# EAGLE design Injector_2.0v (EAGLE 6.5.0)
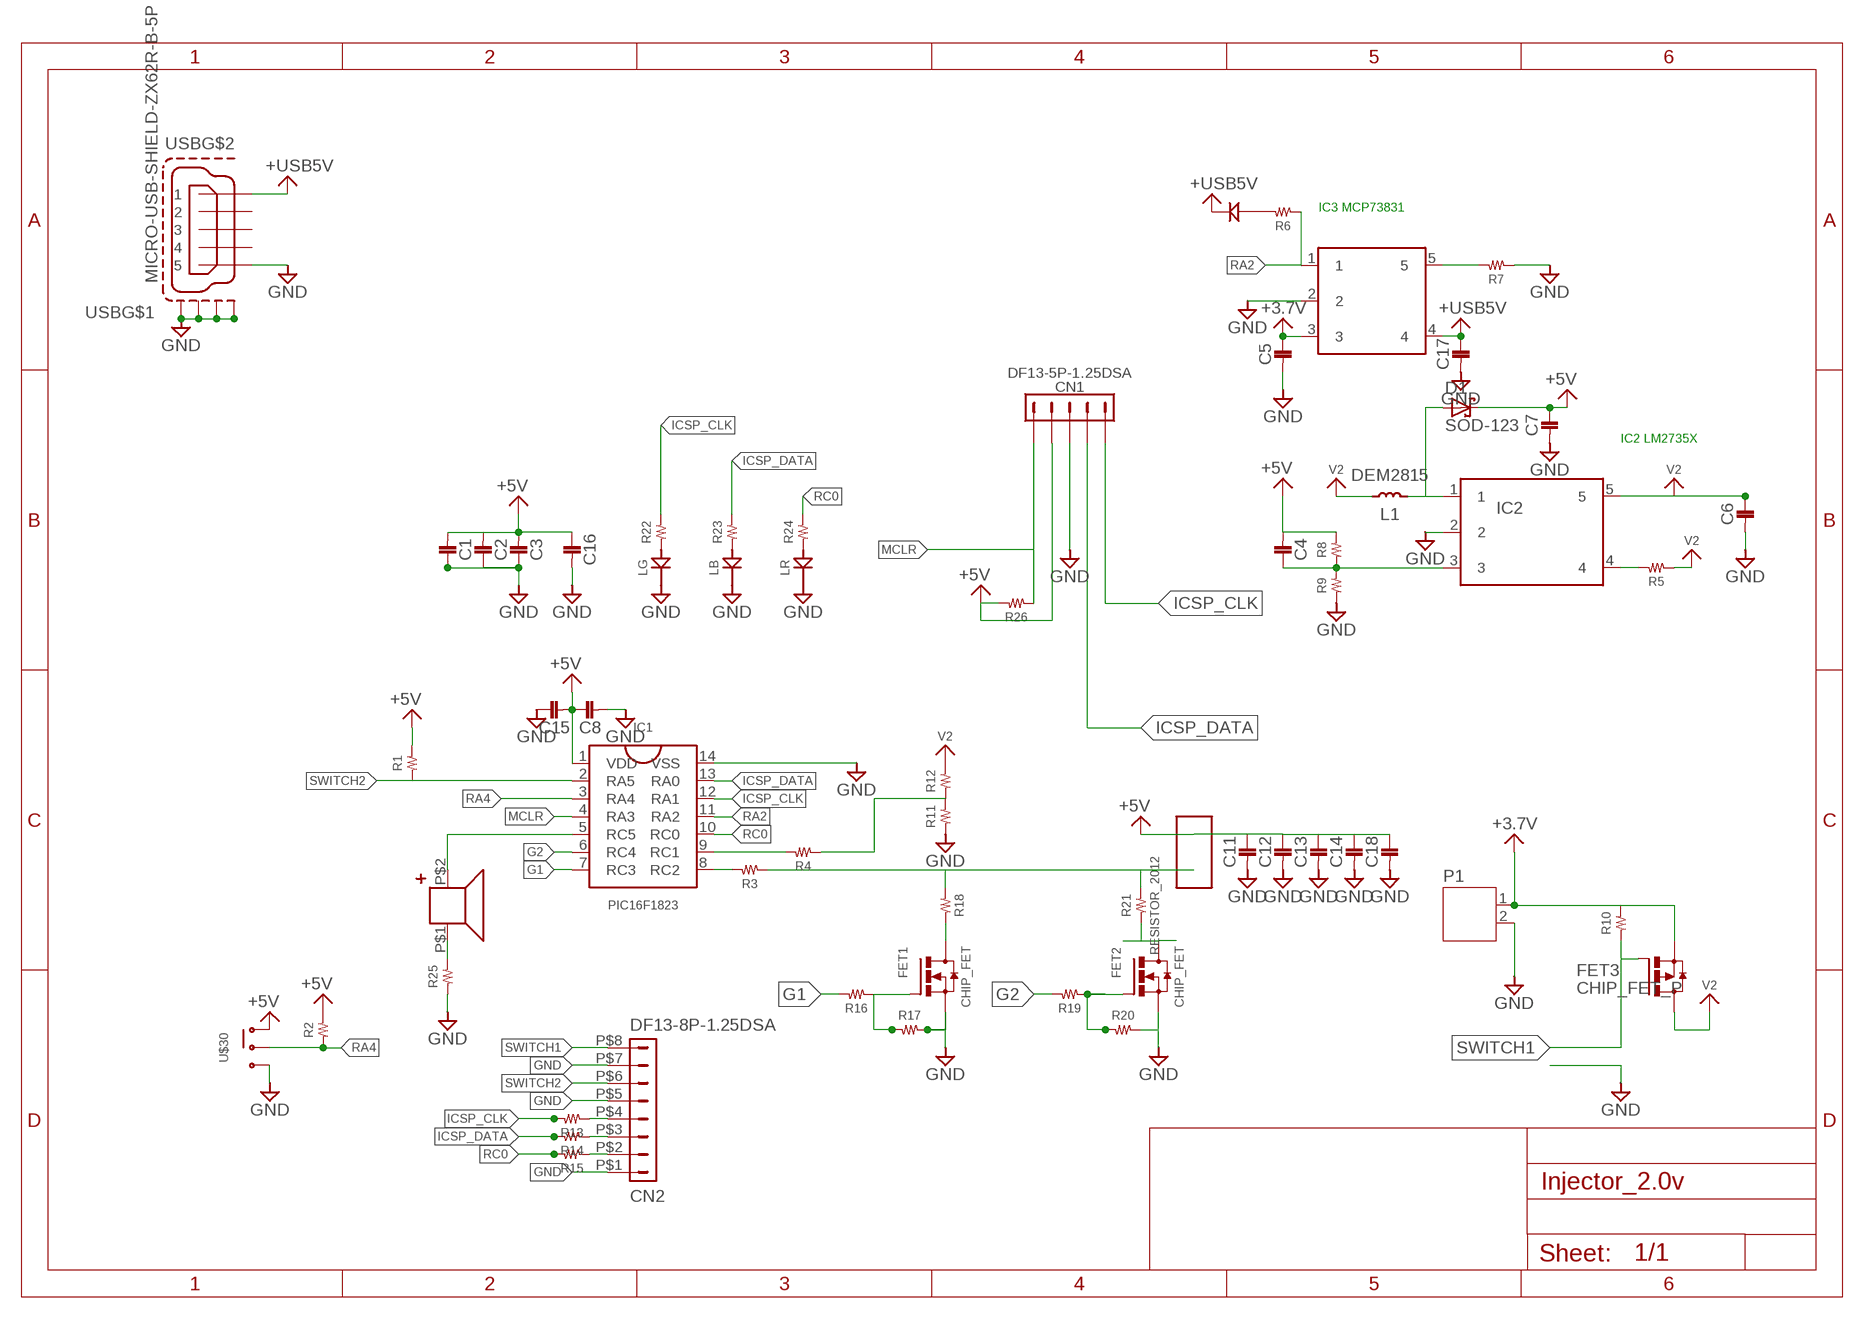
[diagram p0: schematic, sheet 1]

## Parts
C1  1608  [1608]
C2  1608  [1608]
C3  1608  [1608]
C4  1608  [1608]
C5  1608  [1608]
C6  1608  [1608]
C7  1608  [1608]
C8  1608  [1608]
C11  1608  [1608]
C12  1608  [1608]
C13  1608  [1608]
C14  1608  [1608]
C15  1608  [1608]
C16  1608  [1608]
C17  1608  [1608]
C18  1608  [1608]
CN1  DF13-5P-1.25DSA  [DF13-5P-1.25DSA]
CN2  DF13-8P-1.25DSA  [DF13-8P-1.25DSA]
D1  SOD-123  [SOD_123]
FET1  CHIP_FET  [SOT23]
FET2  CHIP_FET  [SOT23]
FET3  CHIP_FET_P  [SOT23]
IC1  PIC16F1823  [TSSOP]
IC2  LM2735  [SOT23-5L]
IC3  MCP73831  [SOT23-5L]
L1  DEM2815  [DEM2815]
LB  CHIPLED  [1608]
LG  CHIPLED  [1608]
LR  CHIPLED  [1608]
P1  JST-PH2  [JST-PH2]
R1  RESISTOR__SMD  [1608]
R2  RESISTOR__SMD  [1608]
R3  RESISTOR__SMD  [1608]
R4  RESISTOR__SMD  [1608]
R5  RESISTOR__SMD  [1608]
R6  RESISTOR__SMD  [1608]
R7  RESISTOR__SMD  [1608]
R8  RESISTOR__SMD  [1608]
R9  RESISTOR__SMD  [1608]
R10  RESISTOR__SMD  [1608]
R11  RESISTOR__SMD  [1608]
R12  RESISTOR__SMD  [1608]
R13  RESISTOR__SMD  [1608]
R14  RESISTOR__SMD  [1608]
R15  RESISTOR__SMD  [1608]
R16  RESISTOR__SMD  [1608]
R17  RESISTOR__SMD  [1608]
R18  RESISTOR__SMD  [1608]
R19  RESISTOR__SMD  [1608]
R20  RESISTOR__SMD  [1608]
R21  RESISTOR_2012  [2012]
R22  RESISTOR__SMD  [1608]
R23  RESISTOR__SMD  [1608]
R24  RESISTOR__SMD  [1608]
R25  RESISTOR__SMD  [1608]
R26  RESISTOR__SMD  [1608]
ST  1608  [1608]
U$15  PKLCS1212E4001  [PKLCS1212E4001]
U$16  PIN_HEADER_2_LARGE  [PIN_HEADER_2S_LARGE]
U$30  SS12D01G4  [SS12D01G4]
USB  MICRO-USB-SHIELD-ZX62R-B-5P  [ZX62R-B-5P]

## Nets
+3.7V: C5.P$1 FET3.2(S) IC3.3 P1.1 R10.2
+5V: C1.P$2 C2.P$2 C3.P$2 C4.P$2 C7.P$1 C8.P$1 C11.P$1 C12.P$1 C13.P$1 C14.P$1 C15.P$2 C16.P$1 C18.P$1 CN1.P$2 D1.C IC1.1(VDD) R1.2 R2.2 R8.2 R26.2 U$16.P$2 U$30.1
+USB5V: C17.P$1 IC3.4 ST.2(K) USB.1
G1: IC1.7(RC3) R16.2
G2: IC1.6(RC4) R19.2
GND: C1.P$1 C2.P$1 C3.P$1 C5.P$2 C6.P$2 C7.P$2 C8.P$2 C11.P$2 C12.P$2 C13.P$2 C14.P$2 C15.P$1 C16.P$2 C17.P$2 C18.P$2 CN1.P$3 CN2.P$1 CN2.P$5 CN2.P$7 FET1.2(S) FET2.2(S) IC1.14(VSS) IC2.2 IC3.2 LB.2(K) LG.2(K) LR.2(K) P1.2 R7.1 R9.1 R11.1 R17.2 R20.2 R25.1 U$30.3 USB.5 USB.M1(S1) USB.M2(S2) USB.M3(S3) USB.M4(S4)
ICSP_CLK: CN1.P$5 IC1.12(RA1) R13.2 R22.2
ICSP_DATA: CN1.P$4 IC1.13(RA0) R14.2 R23.2
MCLR: CN1.P$1 IC1.4(RA3) R26.1
N$1: FET1.1(G) R16.1 R17.1
N$2: FET2.1(G) R19.1 R20.1
N$3: FET1.3(D) R18.2
N$4: FET2.3(D) R21.1
N$5: IC1.5(RC5) U$15.P$2(PLUS)
N$6: R25.2 U$15.P$1(MINUS)
N$8: IC1.8(RC2) R3.2
N$9: IC1.9(RC1) R4.2
N$10: LG.1(A) R22.1
N$11: R3.1 R18.1 R21.2 U$16.P$1
N$12: LB.1(A) R23.1
N$13: D1.A IC2.1 L1.P$2
N$16: IC3.5 R7.2
N$17: LR.1(A) R24.1
N$18: C4.P$1 IC2.3 R8.1 R9.2
N$19: IC2.4 R5.2
N$20: R4.1 R11.2 R12.1
N$21: CN2.P$4 R13.1
N$22: CN2.P$3 R14.1
N$23: CN2.P$2 R15.1
N$24: R6.2 ST.1(A)
RA2: IC1.11(RA2) IC3.1 R6.1
RA4: IC1.3(RA4) R2.1 U$30.2
RC0: IC1.10(RC0) R15.2 R24.2
SWITCH1: CN2.P$8 FET3.1(G) R10.1
SWITCH2: CN2.P$6 IC1.2(RA5) R1.1
V2: C6.P$1 FET3.3(D) IC2.5 L1.P$1 R5.1 R12.2
Unconnected: USB.2 USB.3 USB.4

## Notes on the sheet
- IC3 MCP73831
- IC2 LM2735X

## Library data of the parts
C1-C8 C11-C18 = 02_C:1608
CN1 = con-hirose-df13:DF13-5P-1.25: DF13-5P 1.25mm Pitch Miniature Crimping Connector.
CN2 = con-hirose-df13:DF13-8P-1.25: DF13-8P 1.25mm Pitch Miniature Crimping Connector.
D1 = 15_DIODE:SOD-123
FET1 FET2 = 06_FET:CHIP_FET
FET3 = 06_FET:CHIP_FET_P
IC1 = 04_IC:PIC16F1823
IC2 = 04_IC:LM2735
IC3 = 04_IC:MCP73831
L1 = 03_L:DEM2815
LB LG LR = 10_LED:CHIPLED
P1 = jst-ph:JST-PH2
R1-R20 R22-R26 = 01_R:RESISTOR__SMD
R21 = 01_R:RESISTOR_2012
ST = 10_LED:1608
U$15 = 13_SPEAKER:PKLCS1212E4001
U$16 = 08_CONECTOR:PIN_HEADER_2_LARGE
U$30 = 09_1_switch:SS12D01G4
USB = con-hirose1:MICRO-USB-SHIELD-: Hirose Micro USB Connector ZX62R-B-5P: Micro B, reverse (top mount) shell SMT Supplier: DigiKey H11574CT-ND Source: http://www.hirose.co.jp/cataloge_hp/e24200011.pdf

## Board
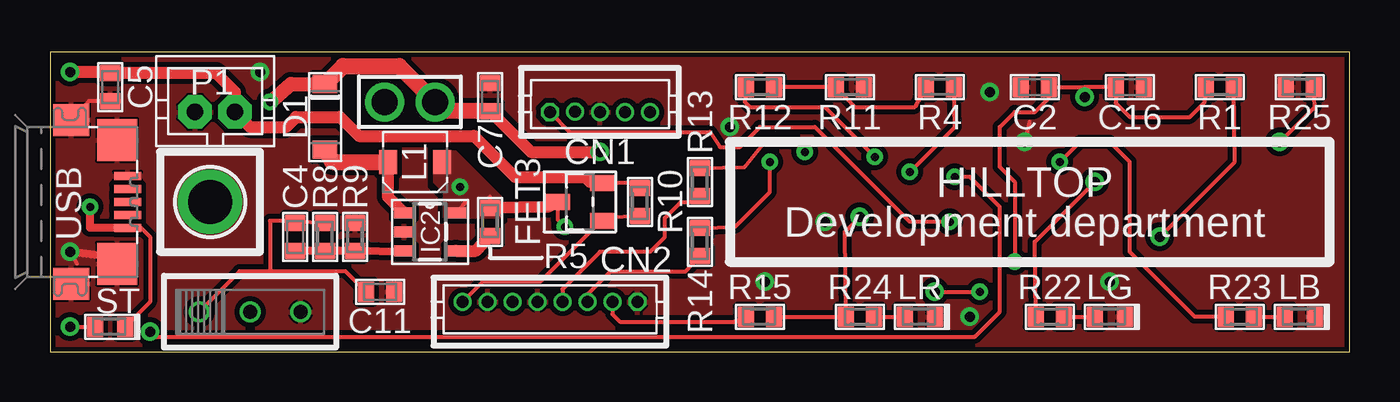
[diagram p1: board, top side]
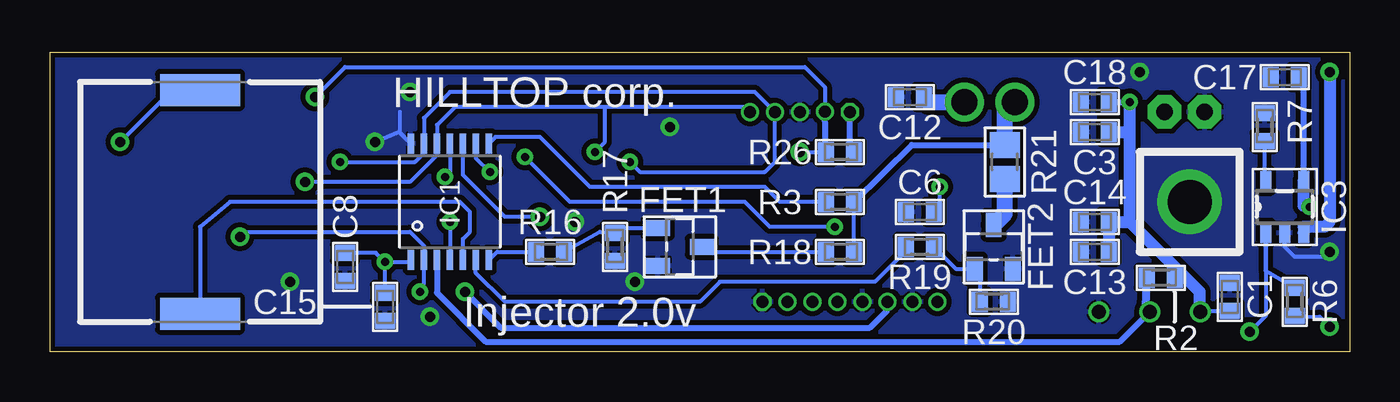
[diagram p2: board, bottom side, seen from below]

Size 65 x 15 mm. Coordinates in mm from the lower left corner, seen from the top.
Outline: 0,0 65,0 65,15 0,15 0,0
Copper layers (1*16): Top 0.035mm / dielectric 1.5mm / Bottom 0.035mm
Design rules "default *": minimum track width 0.2mm, minimum drill 0.4mm, track to track 0.2mm, track to pad 0.2mm, pad to pad 0.2mm, via to via 0.2mm, smd to smd 0.2mm, copper to edge 0.1mm, drill to drill 0.2mm, minimum pad ring 0.15mm, minimum via ring 8mil, stop-mask expansion 4mil, vias tented up to drill 0.5mm, thermal gap 0.1mm
tKeepout: area 6,5.5 to 10,9.5

### Footprints (pad centres in the part's own frame; a part is rotated, then mirrored left to right if it is on the bottom)
1608 = smd 0.8 x 1: P$1 -0.7,0; P$2 0.7,0
DF13-5P-1.25DSA = drill 0.6 pad 0.9 octagon: P$1 2.5,0.005 | drill 0.6 pad 0.9: P$2 1.25,-0.005; P$3 0,0; P$4 -1.25,0; P$5 -2.5,0
DF13-8P-1.25DSA = drill 0.6 pad 0.9 octagon: P$1 4.375,0 | drill 0.6 pad 0.9: P$2 3.125,0; P$3 1.875,0; P$4 0.625,0; P$5 -0.625,0; P$6 -1.875,0; P$7 -3.125,0; P$8 -4.375,0
SOD_123 = smd 0.915 x 1.22: A -1.64,0; C 1.64,0
SOT23 = smd 0.8 x 1.2: 1 -0.95,-1.1; 2 0.95,-1.1; 3 0,1.1
TSSOP = smd 0.305 x 0.991: 1 -1.95,-2.918; 2 -1.3,-2.918; 3 -0.65,-2.918; 4 0,-2.918; 5 0.65,-2.918; 6 1.3,-2.918; 7 1.95,-2.918; 8 1.95,2.918; 9 1.3,2.918; 10 0.65,2.918; 11 0,2.918; 12 -0.65,2.918; 13 -1.3,2.918; 14 -1.95,2.918
SOT23-5L = smd 0.55 x 1: 1 -0.95,-1.3; 2 0,-1.3; 3 0.95,-1.3; 4 0.95,1.3; 5 -0.95,1.3
DEM2815 = smd 0.9 x 1.2: P$1 -1.35,0; P$2 1.35,0
1608' = smd 0.8 x 1: 1 -0.75,0; 2 0.75,0
JST-PH2 = drill 0.813 pad 1.676 octagon: 1 1,0; 2 -1,0
1608'' = smd 0.8 x 1: 1 -0.7,0; 2 0.7,0
2012 = smd 1.3 x 1.5: 1 -0.85,0; 2 0.85,0
PKLCS1212E4001 = smd 1.6 x 4: P$1 -5.6,0; P$2 5.6,0
PIN_HEADER_2S_LARGE = drill 1.3: P$1 -1.27,0; P$2 1.27,0
SS12D01G4 = drill 0.7: 1 -2.54,0; 2 0,0; 3 2.54,0
ZX62R-B-5P = smd 1.35 x 0.4: 1 2.875,-1.3; 2 2.875,-0.65; 3 2.875,0; 4 2.875,0.65; 5 2.875,1.3 | smd 1.8 x 1.6: M1 0.05,-4.1; M2 0.05,4.1 | smd 2 x 2.1: M3 2.35,3.1; M4 2.35,-3.1

### Placement (x,y rotation side)
C1  6,2.75 270 bottom
C2  49.25,13.25 0 top
C3  12.75,11 0 bottom
C4  12.25,5.75 90 top
C5  3,13.25 270 top
C6  21.5,7 180 bottom
C7  22,12.75 90 top
C8  50.25,4.25 270 bottom
C11  16.5,3 0 top
C12  22,12.75 180 bottom
C13  12.75,5 180 bottom
C14  12.75,6.5 180 bottom
C15  48.25,2.25 90 bottom
C16  54,13.25 0 top
C17  3.25,13.75 180 bottom
C18  12.75,12.5 180 bottom
CN1  27.5,12 180 top
CN2  25,2.5 0 top
D1  13.75,11.75 90 top
DRILEGEND  [DRILEGEND]  -15.05,-17.26 0 top  (outside the outline)
FET1  33.5,5.25 270 bottom
FET2  17.8,5.25 0 bottom
FET3  26.5,7.5 90 top
IC1  45,7.5 0 bottom
IC2  19,6 270 top
IC3  3.25,7.25 0 bottom
L1  18.25,9.5 180 top
LB  CHIPLED  [1608']  62.5,1.75 0 top
LG  CHIPLED  [1608']  53,1.75 0 top
LR  CHIPLED  [1608']  43.5,1.75 0 top
P1  8.25,12 0 top
R1  [1608'']  58.5,13.25 180 top
R2  [1608'']  9.45,3.7 0 bottom
R3  [1608'']  25.5,7.5 180 bottom
R4  [1608'']  44.5,13.25 0 top
R5  [1608'']  22,6.5 270 top
R6  [1608'']  2.75,2.5 270 bottom
R7  [1608'']  4.25,11.25 270 bottom
R8  [1608'']  13.75,5.75 90 top
R9  [1608'']  15.25,5.75 270 top
R10  [1608'']  29.5,7.5 90 top
R11  [1608'']  40,13.25 180 top
R12  [1608'']  35.5,13.25 180 top
R13  [1608'']  32.5,8.5 90 top
R14  [1608'']  32.5,5.5 90 top
R15  [1608'']  35.5,1.75 0 top
R16  [1608'']  40,5 180 bottom
R17  [1608'']  36.75,5.25 270 bottom
R18  [1608'']  25.5,5 180 bottom
R19  [1608'']  21.5,5.25 180 bottom
R20  [1608'']  17.8,2.5 0 bottom
R21  17.25,9.5 90 bottom
R22  [1608'']  50,1.75 180 top
R23  [1608'']  59.5,1.75 180 top
R24  [1608'']  40.5,1.75 180 top
R25  [1608'']  62.5,13.25 0 top
R26  [1608'']  25.5,10 180 bottom
ST  1608  [1608']  3,1.25 0 top
U$15  57.5,7.5 270 bottom
U$16  18,12.5 0 top
U$30  10,2 0 top
USB  1,7.5 0 top

### Tracks (layer width: path | path; a pad name or v marks a point on that pad's centre or on a via)
+3.7V  (via drill 0.5)
  Top 0.2: C5.P$1 3,14 | R10.2 29.3,8.45 FET3.2
  Top 0.4: v1,14 1.05,13.95
  Top 0.6: FET3.2 27.55,8.5 27,8.5 26.75,8.75 23.25,8.75 21.2,10.8 15.45,10.8 14.5,11.75 12.3,11.75 11.8,11.25 10,11.25 P1.1 9.25,13 8.3,13.95 C5.P$1 2.95,14 v1,14
  Bottom 0.6: v1,14 1,6.5 1.25,6.25 2.3,6.25 IC3.3
+5V  (via drill 0.4, 0.5)
  Top 0.2: 7.5,2 U$30.1 9.48,4.02 11,4.02 | v48.25,4.5 48.25,8.5 47.5,9.25 47.5,11.25 48.25,12 49.25,12 49.95,12.7 C2.P$2 51.75,13.25 | 51.75,13.25 v51.75,12.75 | 12,6.75 C4.P$2 | C4.P$2 12,6.54 11,6.54 11,4.02 | R8.2 12.3,6.5 C4.P$2 | 51.75,13.25 C16.P$1 53.3,12.45 54,11.75 57,11.75 57.75,12.5 R1.2 | C11.P$1 14.78,4.02 11,4.02
  Top 0.6: C7.P$1 24.05,10 v27.5,10
  Top 0.7: v11,12.5 12.04,13.39 D1.C
  Top 0.8: C7.P$1 19.72,12.05 U$16.P$2 17.47,14.3 14.66,14.3 D1.C
  Bottom 0.2: 46.95,4.55 IC1.1 47.03,4.5 v48.25,4.5 | v51.75,12.75 50.25,14.25 27.25,14.25 26.25,13.25 CN1.P$2 | v27.5,10 R26.2 | v48.25,4.5 48.7,4.95 C8.P$1 | C15.P$2 v48.25,4.5 | U$30.1 7.41,2.05 C1.P$2
  Bottom 0.3: R26.2 CN1.P$2 | C18.P$1 v11,12.5
  Bottom 0.4: 8.7,3.95 R2.2 | 7.5,2.04 U$30.1
  Bottom 0.6: 8.45,3.95 7.5,3 7.5,2.04 | 8.45,3.95 11,6.5 | 11,6.5 11,11 | 11,11 v11,12.5 | C3.P$2 11,11 | 12.05,5.2 C13.P$1 C14.P$1 11,6.5 | 8.7,3.95 8.45,3.95
  Bottom 0.8: C12.P$1 21.05,12.5 U$16.P$2
+USB5V  (via drill 0.4)
  Top 0.2: USB.1 4.55,6.2 5,5.75 5,2.5 ST.2
  Top 0.4: USB.1 2,6.2 v2,7.25
  Bottom 0.2: 2.25,8.5 IC3.4
  Bottom 0.3: IC3.4 2.3,13.5 C17.P$1
  Bottom 0.6: v2,7.25 2.3,7.3 IC3.4
G1
  Bottom 0.2: IC1.7 42.63,5 R16.2
G2
  Bottom 0.2: R19.2 22.25,5 23.75,3.5 31.5,3.5 32.5,2.5 42.25,2.5 43.7,3.95 IC1.6
GND  (via drill 0.5, 2.2)
  Top 0.2: v48.75,10.5 49,11.5 | C5.P$2 1.95,12.55 USB.M2 | 1.35,4.4 v1,5
  Top 0.4: USB.M4 3,4.75 v1,5
  Bottom 0.2: 47.5,12 47.5,10.97 IC1.14 47.53,11 v48.75,10.5 | v1,5 1,4.75 2.75,4.75 3.25,5.25 IC3.2
  other vias: 8,7.5 53,3.5 47,13 35.75,3.5 38.75,6.5 46,1.75 34,11.25 10.5,14
  pour Bottom (isolate 0.25): 0.1,14.9 64.9,14.9 64.9,0.1 0.1,0.1
  pour Top (isolate 0.25, rank 2): 0.1,14.9 64.9,14.9 64.9,0.1 0.1,0.1
ICSP_CLK  (via drill 0.4, 0.5)
  Top 0.2: R13.2 34.75,9.25 35.75,10.5 37.25,10.5 v37.75,10 | R22.2 49.25,5.5 v52.25,8.5
  Bottom 0.2: v52.25,8.5 47,8.5 45.65,9.85 IC1.12 45.65,11.35 44.75,12.25 37.25,12.25 | v37.75,10 37.25,10.5 37.25,12.25 | CN1.P$5 30.25,12.25 37.25,12.25
ICSP_DATA  (via drill 0.4)
  Top 0.2: R14.2 34.25,6.25 36,8 v36,9.5 | R23.2 57.25,1.75 54,5 54,9.5 53,10.5 51.5,10.5 v50.5,9.5
  Bottom 0.2: v36,9.5 35.5,9 29.25,9 28.75,9.5 CN1.P$4 29.75,13 45,13 46.3,11.7 IC1.13 46.3,9.95 46.75,9.5 v50.5,9.5
MCLR  (via drill 0.4)
  Top 0.2: CN1.P$1 26,11 33,11 33.5,10.25 34.5,10.25 35.5,11.25 38.25,11.25 43,6.5 v45,6.5
  Bottom 0.2: v45,6.5 IC1.4
  Bottom 0.3: R26.1 25,9.75 CN1.P$1
N$1
  Bottom 0.2: R16.1 37.5,6 R17.1 36.7,6.2 FET1.1
N$2
  Bottom 0.2: R19.1 19.7,4.15 FET2.1 18.5,3.9 R20.1
N$3
  Bottom 0.2: FET1.3 32.15,5 R18.2
N$4
  Bottom 0.8: 17,8.65 R21.1 17.25,6.9 FET2.3
N$5
  Bottom 0.2: IC1.5 44.35,5.65 44,6 44,7 44.5,7.5 56,7.5 57.5,6.25 U$15.P$2
N$6  (via drill 0.5)
  Top 0.2: v61.5,10.5 63.25,12.25 R25.2
  Bottom 0.2: U$15.P$1 58.9,13.1 v61.5,10.5
N$8
  Bottom 0.2: R3.2 28.5,7.5 29.25,8.25 38,8.25 40.5,10.75 42.72,10.75 IC1.8
N$9  (via drill 0.4)
  Top 0.2: v43,9 45.25,11.25 R4.2
  Bottom 0.2: IC1.9 43.7,9.7 v43,9
N$10
  Top 0.2: R22.1 LG.1
N$11
  Bottom 0.2: R18.1 R3.1 | U$16.P$1 16.73,12.27
  Bottom 0.3: R3.1 21.9,10.35 R21.2
  Bottom 0.8: R21.2 17.25,11.98 U$16.P$1
N$12
  Top 0.2: R23.1 LB.1
N$13
  Top 0.2: L1.P$2 17.01,9.36
  Top 0.6: IC2.1 16.9,7.75 L1.P$2
  Top 0.8: D1.A 14.11,9.5 L1.P$2
N$16
  Bottom 0.2: IC3.5 4.25,8.6 R7.2
N$17
  Top 0.2: R24.1 LR.1
N$18
  Top 0.4: IC2.3 17.65,5 R9.2 R8.1 13.7,5.05 C4.P$1
N$19
  Top 0.6: IC2.4 21.3,5.05 R5.2
N$20
  Top 0.2: R4.1 43.25,12.25 40.25,12.25 R11.2 R12.1
N$21
  Top 0.2: CN2.P$4 25.62,3.12 27.5,5 30,5 30.75,5.75 30.75,6.7 31.55,7.5 32.25,7.5 R13.1
N$22
  Top 0.2: R14.1 31.75,4 28,4 26.88,2.88 CN2.P$3
N$23
  Top 0.2: CN2.P$2 28.12,1.88 28.5,1.5 34.25,1.5 R15.1
N$24  (via drill 0.5)
  Top 0.2: v1,1.25 ST.1
  Bottom 0.2: R6.2 1.5,1.75 v1,1.25
RA2  (via drill 0.4, 0.5)
  Top 0.2: v5,1 5.25,0.75 46.25,0.75 47.5,2 47.5,7.25 46,8.75 v45.25,8.75
  Bottom 0.2: R6.1 4.2,4.05 IC3.1 4.2,1.8 v5,1 | IC1.11 45,9 v45.25,8.75
RA4
  Bottom 0.3: IC1.3 45.65,2.95 43.2,0.5 11.5,0.5 U$30.2
  Bottom 0.4: U$30.2 10.2,2.2 R2.1
RC0  (via drill 0.5)
  Top 0.2: R15.2 R24.2 39.75,6 v40.5,6.75
  Bottom 0.2: v40.5,6.75 42.25,6.75 44.35,8.85 IC1.10
SWITCH1
  Top 0.2: R10.1 27.8,6.75 FET3.1 27.55,6.55 24.5,3.5 21.62,3.5 CN2.P$8
SWITCH2  (via drill 0.4, 0.5)
  Top 0.2: v44.25,3 v46.5,3 | v55.5,5.75 59.25,9.5 R1.1
  Bottom 0.2: v46.5,3 46.3,3.45 IC1.2 46.3,5.3 47,6 55.25,6 v55.5,5.75
  Bottom 0.3: v44.25,3 42.45,1.2 24,1.2 23.12,2.08 CN2.P$6
V2  (via drill 0.4)
  Top 0.2: IC2.5 20.75,7.45 | R5.1 22,7.75 | R12.2 34.75,12.5 35,12.25 38.75,12.25 v41.25,9.75 | 25.5,7.4 FET3.3 25.4,6.6 v25.75,6.25
  Top 0.6: FET3.3 24.9,7.25 R5.1
  Bottom 0.2: C6.P$1 20.5,7 v20.5,8.25 | v25.75,6.25 29,6.25 30.25,7.5 39,7.5 v41.25,9.75
  pour Top (no thermals): 19.25,10 20.25,10 22.5,7.75 22.5,6.75 19.75,6.75 19.75,8 19.25,8.5

### Text on the board
tPlace: HILLTOP | Development department
bPlace: HILLTOP corp. | Injector 2.0v
DrillLegend_01-20: 穴図